# Altium schematic sheet 1_123456_01.SchDoc: Overview
size A3; SMDPrint: SMD: 38.005??     Print: 07.005??A; DocumentNumber: 1; SheetNumber: 1; SheetTotal: 2; PageSetup: Record=PageOptions|CenterHorizontal=True|CenterVertical=True|PrintScale=0.71|XCorrection=1.00|YCorrection=1.00|PrintKind=1|BorderSize=5000000|LeftOffset=0|BottomOffset=0|Orientation=2|PaperLength=1000|PaperWidth=1000|Scale=100|PaperSource=15|PrintQuality=600|MediaType=1|DitherType=10|PrintScaleMode=1|PaperKind=A4 (210 x 297 mm)|PaperIndex=9
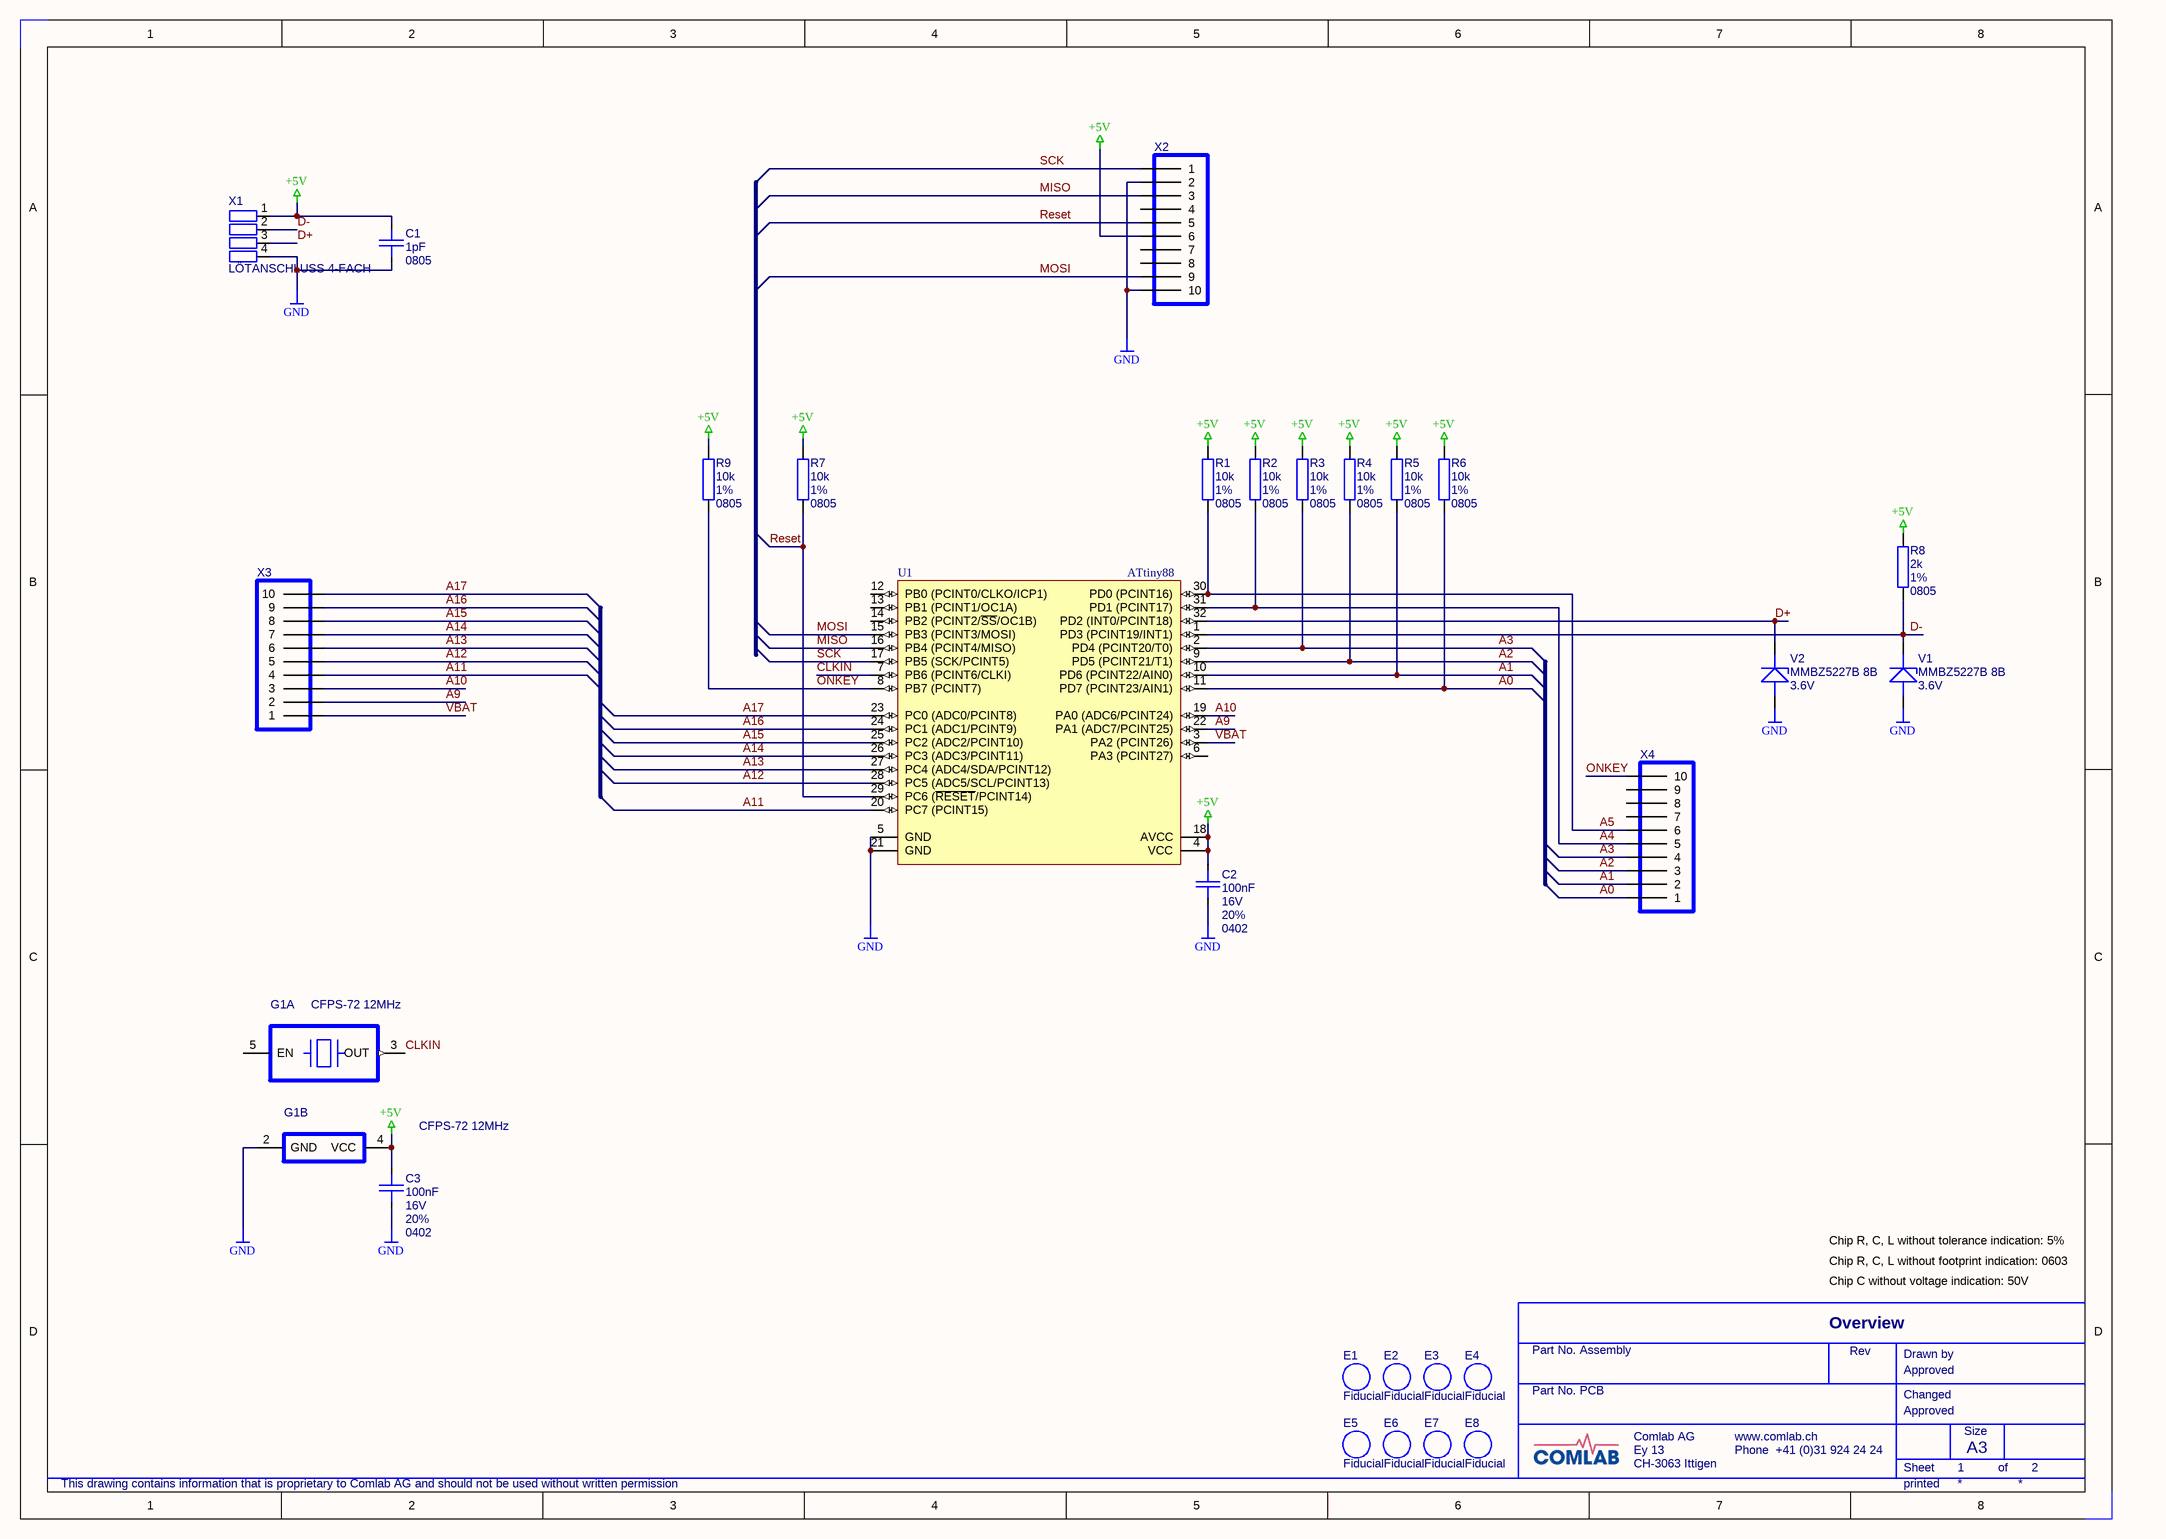
[diagram p0: 1_123456_01.SchDoc]

## Parts
C1  Footprint: 0805  [0805C]  (hidden comment: 1pF)
C2  Spannung: 16V  Toleranz: 20%  Footprint: 0402  [0402C]  (hidden comment: 100nF)
C3  Spannung: 16V  Toleranz: 20%  Footprint: 0402  [0402C]  (hidden comment: 100nF)
E1  Fiducial  [ZENTRIER Fiducial]
E2  Fiducial  [ZENTRIER Fiducial]
E3  Fiducial  [ZENTRIER Fiducial]
E4  Fiducial  [ZENTRIER Fiducial]
E5  Fiducial  [ZENTRIER Fiducial]
E6  Fiducial  [ZENTRIER Fiducial]
E7  Fiducial  [ZENTRIER Fiducial]
E8  Fiducial  [ZENTRIER Fiducial]
G1  CFPS-72 12MHz  [TW0203A]  (parts A,B of 2)
R1  Toleranz: 1%  Footprint: 0805  [0805R]  (hidden comment: 10k)
R2  Toleranz: 1%  Footprint: 0805  [0805R]  (hidden comment: 10k)
R3  Toleranz: 1%  Footprint: 0805  [0805R]  (hidden comment: 10k)
R4  Toleranz: 1%  Footprint: 0805  [0805R]  (hidden comment: 10k)
R5  Toleranz: 1%  Footprint: 0805  [0805R]  (hidden comment: 10k)
R6  Toleranz: 1%  Footprint: 0805  [0805R]  (hidden comment: 10k)
R7  Toleranz: 1%  Footprint: 0805  [0805R]  (hidden comment: 10k)
R8  Toleranz: 1%  Footprint: 0805  [0805R]  (hidden comment: 2k)
R9  Toleranz: 1%  Footprint: 0805  [0805R]  (hidden comment: 10k)
U1  ATtiny88  [32A_N]
V1  Zener-Spannung: 3.6V  [SOT-23]  (hidden comment: MMBZ5227B 8B)
V2  Zener-Spannung: 3.6V  [SOT-23]  (hidden comment: MMBZ5227B 8B)
X1  LÖTANSCHLUSS 4-FACH  [LÖTANSCHLUSS 4X 2X5MM]  (no BOM)
X2  Header 10P  [XHEAD2R10PR1.27MMSB SMD]  (value not drawn)
X3  Header 10P  [XHEAD2R10PR1.27MMSB SMD]  (value not drawn)
X4  Header 10P  [XHEAD2R10PR1.27MMSB SMD]  (value not drawn)

## Nets
+5V: C1.1 C2.1 C3.1 G1.4(VCC) R1.2 R2.2 R3.2 R4.2 R5.2 R6.2 R7.2 R8.2 R9.2 U1.4(VCC) U1.18(AVCC) X1.1 X2.6
GND: C1.2 C2.2 C3.2 G1.2(GND) U1.5(GND) U1.21(GND) V1.1(a) V2.1(a) X1.4 X2.2 X2.10
A0: R6.1 U1.11(PD7_(PCINT23/AIN1)) X4.1
A1: R5.1 U1.10(PD6_(PCINT22/AIN0)) X4.2
A2: R4.1 U1.9(PD5_(PCINT21/T1)) X4.3
A3: R3.1 U1.2(PD4_(PCINT20/T0)) X4.4
A4: R2.1 U1.31(PD1_(PCINT17)) X4.5
A5: R1.1 U1.30(PD0_(PCINT16)) X4.6
A9: U1.22(PA1_(ADC7/PCINT25)) X3.2
A10: U1.19(PA0_(ADC6/PCINT24)) X3.3
A11: U1.20(PC7_(PCINT15)) X3.4
A12: U1.28(PC5_(ADC5/SCL/PCINT13)) X3.5
A13: U1.27(PC4_(ADC4/SDA/PCINT12)) X3.6
A14: U1.26(PC3_(ADC3/PCINT11)) X3.7
A15: U1.25(PC2_(ADC2/PCINT10)) X3.8
A16: U1.24(PC1_(ADC1/PCINT9)) X3.9
A17: U1.23(PC0_(ADC0/PCINT8)) X3.10
CLKIN: G1.3(OUT) U1.7(PB6_(PCINT6/CLKI))
D+: U1.32(PD2_(INT0/PCINT18)) V2.3(k) X1.3
D-: R8.1 U1.1(PD3_(PCINT19/INT1)) V1.3(k) X1.2
MISO: U1.16(PB4_(PCINT4/MISO)) X2.3
MOSI: U1.15(PB3_(PCINT3/MOSI)) X2.9
ONKEY: R9.1 U1.8(PB7_(PCINT7)) X4.10
Reset: R7.1 U1.29(PC6_(~{RESET}/PCINT14)) X2.5
SCK: U1.17(PB5_(SCK/PCINT5)) X2.1
VBAT: U1.3(PA2_(PCINT26)) X3.1

Not connected (* = marked no-connect by the designer): G1 5(EN); U1 6(PA3_(PCINT27)) 12(PB0_(PCINT0/CLKO/ICP1)) 13(PB1_(PCINT1/OC1A)) 14(PB2_(PCINT2/~{SS}/OC1B)); X2 4 7 8; X4 7 8 9

## Notes on the sheet
- Chip R, C, L without tolerance indication: 5%
- Chip R, C, L without footprint indication: 0603
- Chip C without voltage indication: 50V
- Part No. Assembly
- Part No. PCB
- Rev
- Drawn by
- Approved
- Changed
- Ey 13
- CH-3063 Ittigen
- Comlab AG
- www.comlab.ch
- Phone  +41 (0)31 924 24 24
- Sheet
- Size
- A3
- of
- This drawing contains information that is proprietary to Comlab AG and should not be used without written permission
- printed

## Library data of the parts
C1 = (1pF  0805  15.00064: Kond/Chip-Kondensator; Artikelnummer IN-ERP: 101384; Material Gruppe: 07; Lagerbestand: 2914; Status Artikel: Normal; Bezeichnung 1: 1pF/50V, ±0.1pF, COG, 0805; Grundpreis: 0.0083; Lieferant: Rutronik; Lieferant Best.Nr: KKK18586; Toleranz: 0.1p; Artikelnummer Damgaard: 15.00064; Datum Library Update: 26.08.2016; Bezeichnung 2: Chip-Kondensator; Rev: 1; Value: 1pF
C2 C3 = 1uF  0402  118194: Kond/Chip-Kondensator; Material Gruppe: 07; Grundpreis: 0.0258; Lagerbestand: 876; Status Artikel: Normal; Lieferant: DIGI-KEY; Lieferant Best.Nr: PCC2257CT-ND; Bezeichnung 2: Chip-Kondensator; Datum Library Update: 26.08.2016; Rev: 1; Value: 100nF
E1-E8 = ZENTRIERMARKE Fiducial: Zubehör/Zentriermarke, 2...8x diagonal auf jedem Print; Artikelnummer IN-ERP: Zentriermarke Fiducial; Rev: 1; Value: Fiducial
G1 = OSZI: 8MHz TW0203  TW0203A  117861: RF/OSZI; Artikelnummer IN-ERP: 117861; Material Gruppe: 09; Bezeichnung 1: TW0203A, SMD 3.2x5mm; Bezeichnung 2: Crystal-Oscill. 8MHz, ±30ppm@-20...+70°C, 3.3V; Lagerbestand: 45; Status Artikel: Normal; Datum Library Update: 07.04.2016; ComponentLink1Description: Datenblatt; ComponentLink1URL: g:\Entwicklung\DATENBLAETTER\Artikelnummer COMLAB\117861\; Rev: 1; Value: CFPS-72 12MHz
R1-R9 = (1K  0805  14.00130: Wid/Chip-Widerstand; Artikelnummer IN-ERP: 101095; Material Gruppe: 06; Lagerbestand: 5992; Status Artikel: Normal; Bezeichnung 1: 1K, 1%, 0.1W, 0805; Grundpreis: 0.0057; Lieferant: Rutronik; Lieferant Best.Nr: WRC32151; Artikelnummer Damgaard: 14.00130; Datum Library Update: 26.08.2016; Bezeichnung 2: Chip-Widerstand; Rev: 1
  R1-R7 R9: Value: 10k
  R8: Value: 2k
U1 = ATtiny88-AU: 8-bit AVR Microcontroller, 1.8-5.5V, 8KB Flash, 64 Bytes EEPROM, 512 Bytes SRAM, 32-pin TQFP, Industrial Grade (-40°C to 85°C), Pb-Free; Published: 1-Apr-2010; DatasheetVersion: revC, Mar-2009; PackageVersion: revB, Oct-2001; PackageReference: 32A; Publisher: Altium Limited; PackageDescription: 32-Lead, 7x7x1.0 mm Body, 0.8mm Lead Pitch, Thin Profile Plastic Quad Flat Package (TQFP); Supplier 1: Digi-Key; Supplier Part Number 1: ATTINY88-AU-ND; Supplier 2: Farnell; Supplier Part Number 2: 1704570; Supplier 3: Mouser; Supplier Part Number 3: 556-ATTINY88-AU; Code_JEDEC: MS-026-ABA; ComponentLink1Description: Manufacturer Link; ComponentLink1URL: http://www.atmel.com/products/avr/default.asp?; ComponentLink2Description: ATtiny48/88 Datasheet; ComponentLink2URL: http://www.atmel.com/dyn/resources/prod_documents/doc8008.pdf; ComponentLink3Description: ATtiny48/88 Summary; ComponentLink3URL: http://www.atmel.com/dyn/resources/prod_documents/8008S.pdf; ComponentLink4Description: Atmel.com Home; ComponentLink4URL: http://www.atmel.com
V1 V2 = MMBZ5227B 8B  SOT-23  10.00022: Semidisc/Zener-Diode; Artikelnummer IN-ERP: 100583; Material Gruppe: 04; Lagerbestand: 768; Status Artikel: Normal; Bezeichnung 1: MMBZ5227B 8B, SOT-23; Bezeichnung 2: Zener-Diode 3.6V, 250mW; Grundpreis: 0.0355; Lieferant: DIGI-KEY; Lieferant Best.Nr: 568-6327-6-ND; Artikelnummer Damgaard: 10.00022; Datum Library Update: 26.08.2016; ComponentLink1Description: Datenblatt; ComponentLink1URL: G:\Entwicklung\DATENBLAETTER\Artikelnummer COMLAB\100583; Rev: 1; Value: MMBZ5227B 8B
X1 = LÖTANSCHLUSS 4-FACH  LÖTANSCHLUSS 4X 2X5MM  -: Stecker/Lötanschluss; Artikelnummer Damgaard: -; Beschrieb: 4x 2x5mm; Value: LÖTANSCHLUSS 4-FACH; Rev: 1
X2-X4 = HEADER10P  XHEAD2R20PR0.5SB  119896: Stecker/Headerf Stehend; Artikelnummer IN-ERP: 119896; Bezeichnung 1: 2x 5Pm; Bezeichnung 2: R1.27; Material Gruppe: 35; Status Artikel: Normal; Grundpreis: 2.0149; Lagerbestand: 5; Lieferant: DIGI-KEY; Lieferant Best.Nr: 952-1368-5-ND; Herst. 1: Harwin; Herst. 1 ArtNr.: M50-3001045; Footprint: XHEAD2R20PR0.5SB; ComponentLink1Description: Datenblatt; Datum Library Update: 26.08.2016; Rev: 1